# Altium schematic sheet Opto.SchDoc
size A
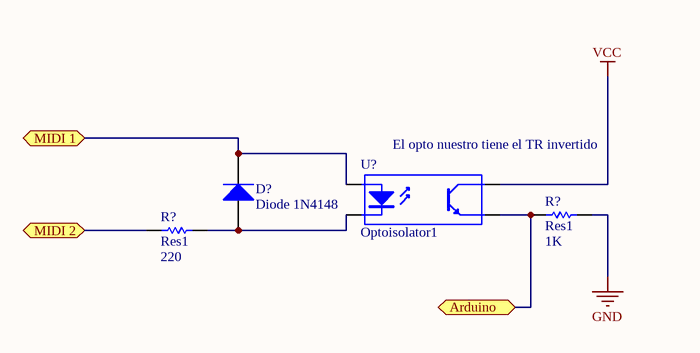
[diagram p0: Opto.SchDoc]

## Parts
(Parts that share a designator on the sheet are numbered #1, #2 ... from top to bottom, then left to right.)
D?  Diode 1N4148  [DO-35]
R?#1  Res1  value 1K  [AXIAL-0.3]
R?#2  Res1  value 220  [AXIAL-0.3]
U?  Optoisolator1  [DIP-4]

## Ports
Arduino, MIDI 1, MIDI 2

## Nets
GND: R?#1.2
VCC: U?.4(C)
Arduino: R?#1.1 U?.3(E) ; port Arduino
MIDI 1: D?.2(K) U?.1(A) ; port MIDI 1
MIDI 2: R?#2.1 ; port MIDI 2
NetD?_1: D?.1(A) R?#2.2 U?.2(K)

## Notes on the sheet
- (near U?) El opto nuestro tiene el TR invertido

## Library data of the parts
D? = Diode 1N4148: High Conductance Fast Diode; Published: 8-Jun-2000; LatestRevisionDate: 17-Jul-2002; LatestRevisionNote: Re-released for DXP Platform.; DatasheetVersion: 1997; PackageReference: DO-35; Publisher: Altium Limited; PackageDescription: Diode, Axial; Body 3.8 x 1.9 mm (LxDia. max), Lead Dia. 0.53 mm (max); Code_JEDEC: DO-204-AH; ComponentLink1Description: Manufacturer Link; ComponentLink1URL: http://www.fairchildsemi.com/; ComponentLink2Description: Datasheet; ComponentLink2URL: http://www.fairchildsemi.com/ds/1N%2F1N4148.pdf
R?#1 R?#2 = Res1: Resistor; Published: 8-Jun-2000; LatestRevisionDate: 17-Jul-2002; LatestRevisionNote: Re-released for DXP Platform.; PackageReference: AXIAL-0.3; Publisher: Altium Limited; PackageDescription: Axial Device, Thru-Hole; 2 Leads; 0.3 in Pin Spacing
U? = Optoisolator1: 4-Pin Phototransistor Optocoupler; Published: 24-Mar-1999; LatestRevisionDate: 04-Mar-2005; LatestRevisionNote: Sch pins 3 & 4 Swapped.; DatasheetVersion: Nov-2003; PackageReference: DIP-4; Publisher: Altium Limited